# Altium schematic sheet Sheet2.SchDoc: Detectir CSN mod. Edu
size A4; Organization: LIM-HGGM; Address1: RCP; DocumentNumber: 1; Revision: 1; SheetNumber: 2; SheetTotal: 2
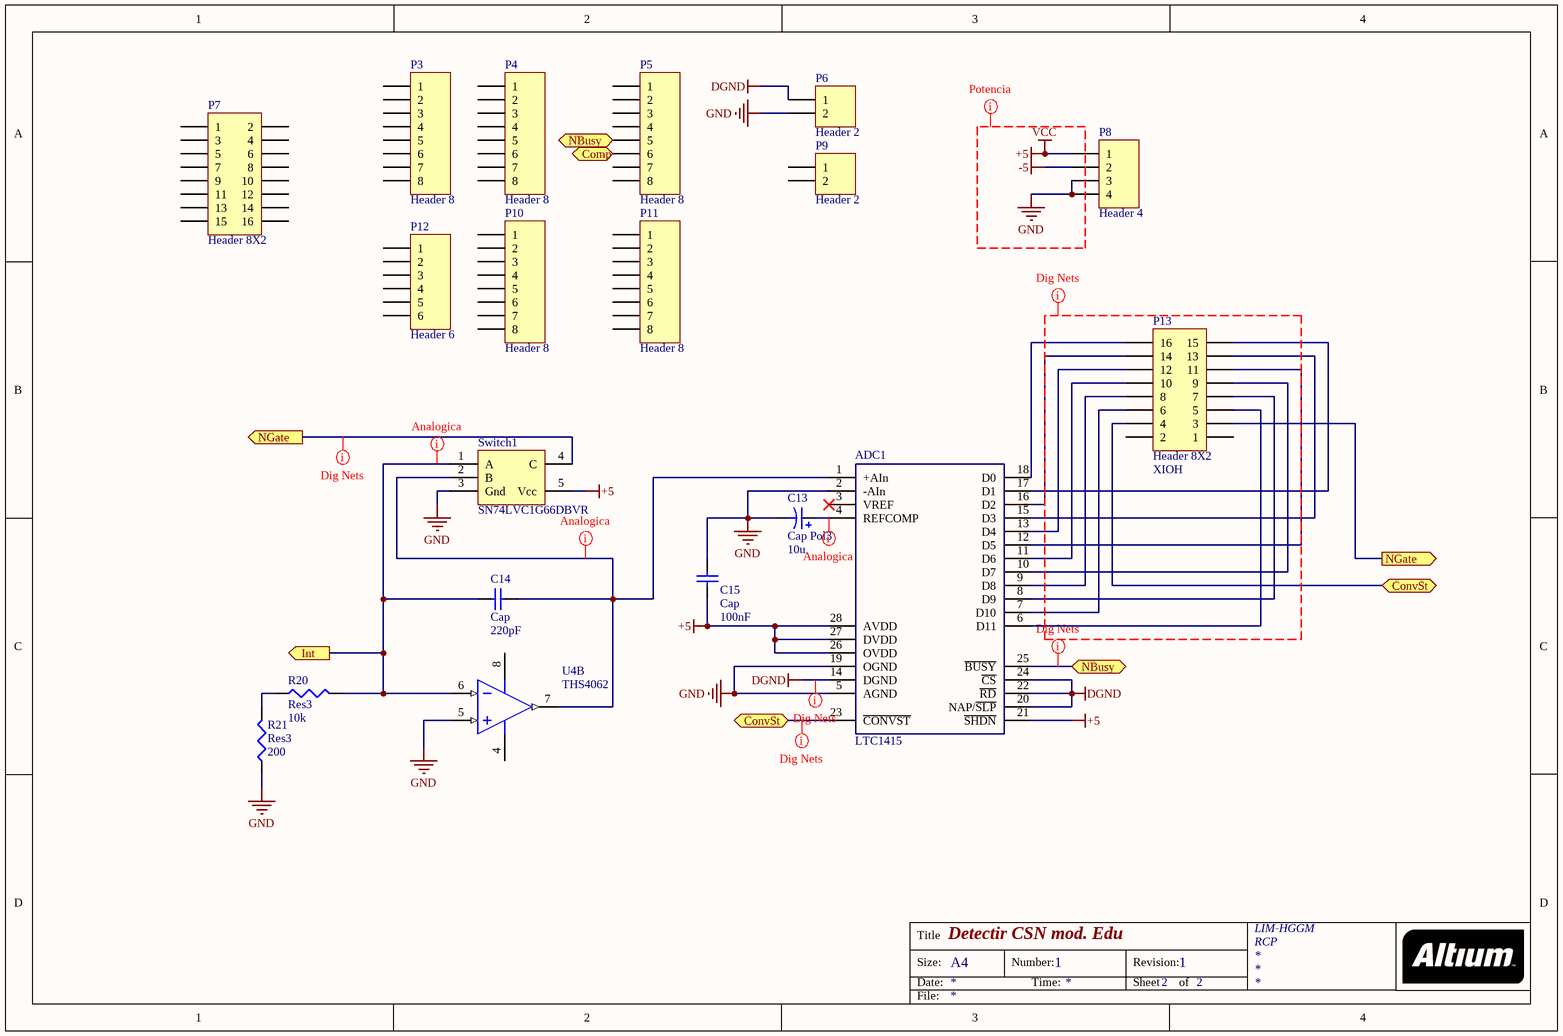
[diagram p0: Sheet2.SchDoc]

## Parts
ADC1  LTC1415  [SO28_N]
C13  Cap Pol3  value 10u  [C0805]
C14  Cap  value 220pF  [6-0805_N]
C15  Cap  value 100nF  [6-0805_N]
P3  Header 8  [HDR1X8]
P4  Header 8  [HDR1X8]
P5  Header 8  [HDR1X8]
P6  Header 2  [HDR1X2]
P7  Header 8X2  [HDR2X8]
P8  Header 4  [HDR1X4]
P9  Header 2  [HDR1X2]
P10  Header 8  [HDR1X8]
P11  Header 8  [HDR1X8]
P12  Header 6  [HDR1X6]
P13  Header 8X2  Con_Arduino: XIOH  [HDR2X8]
R20  Res3  value 10k  [6-0805_N]
R21  Res3  value 200  [6-0805_N]
Switch1  SN74LVC1G66DBVR  [SOT23-5_N]
U4  THS4062  [S8_N]  (part B of 2)

## Ports
Comp (out), ConvSt, Int (out), NBusy, NGate (out)

## Nets
+5: ADC1.21(~{SHDN}) ADC1.26(OVDD) ADC1.27(DVDD) ADC1.28(AVDD) C15.1 P8.1 Switch1.5(Vcc)  [also labelled VCC]
-5: P8.2
DGND: ADC1.14(DGND) ADC1.20(NAP/~{SLP}) ADC1.22(~{RD}) ADC1.24(~{CS}) P6.1
GND: ADC1.2(-AIn) ADC1.5(AGND) ADC1.19(OGND) C13.2 C15.2 P6.2 P8.3 P8.4 R21.1 Switch1.3(Gnd) U4.5(IN+)
Comp: P5.6 ; port Comp
ConvSt: ADC1.23(~{CONVST}) P13.4 ; port ConvSt
Int: C14.1 R20.2 Switch1.1(A) U4.6(IN-) ; port Int
NBusy: ADC1.25(~{BUSY}) P5.5 ; port NBusy
NGate: P13.3 Switch1.4(C) ; port NGate
NetADC1_1: ADC1.1(+AIn) C14.2 Switch1.2(B) U4.7(OUT)
NetADC1_4: ADC1.4(REFCOMP) C13.1
NetADC1_6: ADC1.6(D11) P13.5
NetADC1_7: ADC1.7(D10) P13.6
NetADC1_8: ADC1.8(D9) P13.7
NetADC1_9: ADC1.9(D8) P13.8
NetADC1_10: ADC1.10(D7) P13.9
NetADC1_11: ADC1.11(D6) P13.10
NetADC1_12: ADC1.12(D5) P13.11
NetADC1_13: ADC1.13(D4) P13.12
NetADC1_15: ADC1.15(D3) P13.13
NetADC1_16: ADC1.16(D2) P13.14
NetADC1_17: ADC1.17(D1) P13.15
NetADC1_18: ADC1.18(D0) P13.16
NetR20_1: R20.1 R21.2

Not connected (* = marked no-connect by the designer): ADC1 3(VREF)*; P3 1 2 3 4 5 6 7 8; P4 1 2 3 4 5 6 7 8; P5 1 2 3 4 7 8; P7 1 2 3 4 5 6 7 8 9 10 11 12 13 14 15 16; P9 1 2; P10 1 2 3 4 5 6 7 8; P11 1 2 3 4 5 6 7 8; P12 1 2 3 4 5 6; P13 1 2; U4 4(V-) 8(V+)

## Layout directives
net class digital: (no net found under the mark), ConvSt, DGND, NBusy, NGate
net class potencia: +5, -5, GND, VCC
net class analog: Int, NetADC1_1, NetADC1_4

## Notes on the sheet
- Title
- Size:
- Date:
- A4
- Number:
- Time:
- Revision:
- Sheet
- of
- File:

## Library data of the parts
C13 = Cap Pol3: Polarized Capacitor (Surface Mount); Published: 8-Jun-2000; LatestRevisionDate: 29-May-2009; LatestRevisionNote: IPC-7351 Footprint Added.; PackageReference: C0805; Publisher: Altium Limited; PackageDescription: Chip Capacitor
C14 C15 = Cap: Capacitor; Published: 8-Jun-2000; LatestRevisionDate: 17-Jul-2002; LatestRevisionNote: Re-released for DXP Platform.; PackageReference: RAD-0.3; Publisher: Altium Limited; PackageDescription: Radial Cap, Thru-Hole; 2 Leads; 0.3 in Pin Spacing
P3-P5 P10 P11 = Header 8: Header, 8-Pin; LatestRevisionDate: 17-Jul-2002; LatestRevisionNote: Re-released for DXP Platform.; Publisher: Altium Limited
P6 P9 = Header 2: Header, 2-Pin; LatestRevisionDate: 17-Jul-2002; LatestRevisionNote: Re-released for DXP Platform.; Publisher: Altium Limited
P7 P13 = Header 8X2: Header, 8-Pin, Dual row; LatestRevisionDate: 17-Jul-2002; LatestRevisionNote: Re-released for DXP Platform.; Publisher: Altium Limited
P8 = Header 4: Header, 4-Pin; LatestRevisionDate: 17-Jul-2002; LatestRevisionNote: Re-released for DXP Platform.; Publisher: Altium Limited
P12 = Header 6: Header, 6-Pin; LatestRevisionDate: 17-Jul-2002; LatestRevisionNote: Re-released for DXP Platform.; Publisher: Altium Limited
R20 R21 = Res3: Resistor; Published: 8-Jun-2000; LatestRevisionDate: 29-May-2009; LatestRevisionNote: IPC-7351 Footprint Added.; PackageReference: J1-0603; Publisher: Altium Limited; PackageDescription: Chip Resistor
U4 = LT1253CS8: Low Cost Dual Video Amplifier; Note: 1003; Published: 8-Jun-2000; LatestRevisionDate: 13-Apr-2006; LatestRevisionNote: IPC-7351 Footprint Added.; DatasheetVersion: 1996; PackageReference: S8; Publisher: Altium Limited; PackageDescription: 8-Pin Small Outline Integrated Circuit 1.27 mm Pitch; Code_JEDEC: MS-012-AA; Code_IPC: SOIC127P600-8; ComponentLink1Description: Manufacturer Link; ComponentLink1URL: http://www.linear.com/; ComponentLink2Description: Datasheet; ComponentLink2URL: http://www.linear.com/pc/downloadDocument.do?navId=H0,C1,C1154,C1009,C1022,P1423,D1129